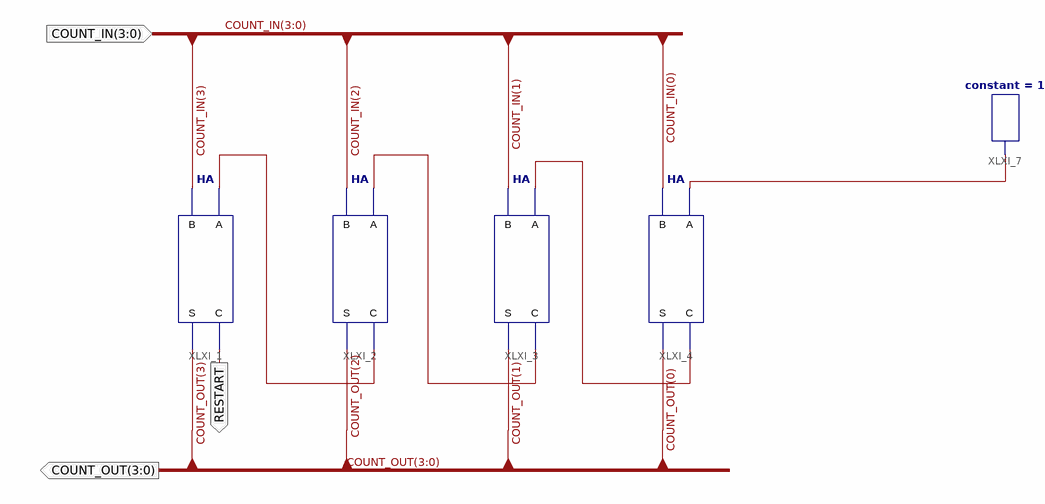
[diagram p0: schematic sheet 1]
// Xilinx ISE schematic ADDER_4.sch (spartan3e) as structural Verilog: 5 symbols, 3 ports
module ADDER_4 (
  input  [3:0] COUNT_IN,
  output [3:0] COUNT_OUT,
  output RESTART
);

  wire XLXN_1, XLXN_3, XLXN_4, XLXN_5;

  HA XLXI_1 (.A(XLXN_5), .B(COUNT_IN[3]), .C(RESTART), .S(COUNT_OUT[3]));
  HA XLXI_2 (.A(XLXN_4), .B(COUNT_IN[2]), .C(XLXN_5), .S(COUNT_OUT[2]));
  HA XLXI_3 (.A(XLXN_3), .B(COUNT_IN[1]), .C(XLXN_4), .S(COUNT_OUT[1]));
  HA XLXI_4 (.A(XLXN_1), .B(COUNT_IN[0]), .C(XLXN_3), .S(COUNT_OUT[0]));
  constant #(.CValue("1")) XLXI_7 (.O(XLXN_1));
endmodule
